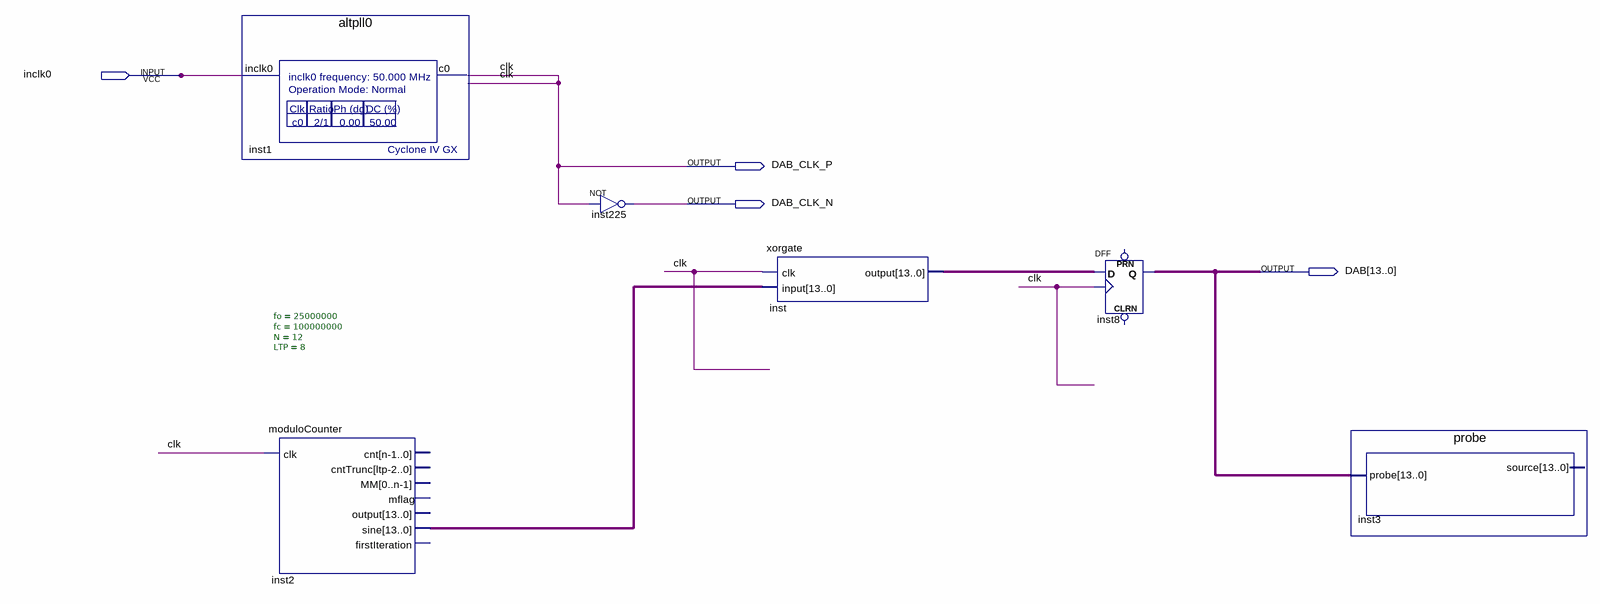
[diagram p0: schematic sheet]
// Quartus schematic ddsCoreTest.bdf as structural Verilog: 6 symbols, 4 pins
module ddsCoreTest (
  input  inclk0,
  output DAB_CLK_P,
  output DAB_CLK_N,
  output [13:0] DAB
);

  wire [13:0] inst2_sine, inst_output;

  altpll0 inst1 (.inclk0(inclk0), .c0(DAB_CLK_P));
  moduloCounter #(.fo(25000000), .fc(100000000), .N(12), .LTP(8)) inst2 (
    .clk(DAB_CLK_P), .sine(inst2_sine));  // open: cnt, cntTrunc, MM, mflag, output, firstIteration
  not inst225 (DAB_CLK_N, DAB_CLK_P);
  xorgate inst (.clk(DAB_CLK_P), .\input (inst2_sine), .\output (inst_output));
  DFF inst8[13:0] (.CLK(DAB_CLK_P), .D(inst_output), .Q(DAB));  // open: CLRN, PRN
  probe inst3 (.probe(DAB));  // open: source

  // Other names for the same wires on the sheet: clk = DAB_CLK_P
endmodule
